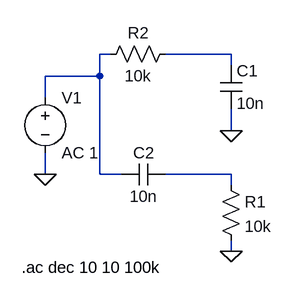
[diagram p0: schematic lop-hip_mag-phase.asc]
lop-hip_mag-phase.asc, the LTspice schematic file:
Version 4
SHEET 1 880 680
WIRE 160 48 144 48
WIRE 336 48 240 48
WIRE 336 64 336 48
WIRE 144 80 144 48
WIRE 144 80 64 80
WIRE 64 112 64 80
WIRE 336 160 336 128
WIRE 64 224 64 192
WIRE 144 224 144 80
WIRE 176 224 144 224
WIRE 336 224 240 224
WIRE 336 240 336 224
WIRE 336 336 336 320
FLAG 336 160 0
FLAG 336 336 0
FLAG 64 224 0
SYMBOL res 320 224 R0
SYMATTR InstName R1
SYMATTR Value 10k
SYMBOL res 256 32 R90
WINDOW 0 0 56 VBottom 0
WINDOW 3 32 56 VTop 0
SYMATTR InstName R2
SYMATTR Value 10k
SYMBOL cap 320 64 R0
SYMATTR InstName C1
SYMATTR Value 10n
SYMBOL cap 240 208 R90
WINDOW 0 0 32 VBottom 0
WINDOW 3 32 32 VTop 0
SYMATTR InstName C2
SYMATTR Value 10n
SYMBOL voltage 64 96 R0
WINDOW 123 0 0 Left 0
WINDOW 39 0 0 Left 0
SYMATTR InstName V1
SYMATTR Value AC 1
TEXT 30 360 Left 0 !.ac dec 10 10 100k

The netlist it stands for:
* lop-hip_mag-phase.asc
R1 N003 0 10k
R2 N002 N001 10k
C1 N002 0 10n
C2 N003 N001 10n
V1 N001 0 AC 1
.ac dec 10 10 100k
.backanno
.end